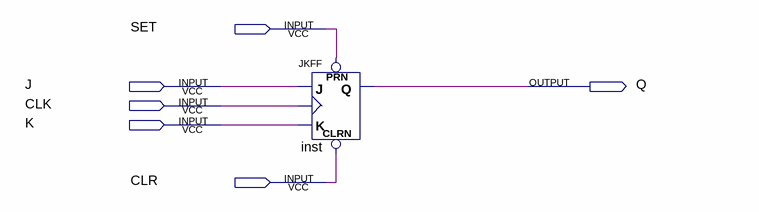
[diagram p0: schematic sheet]
// Quartus schematic ea01m02e02JK.bdf as structural Verilog: 1 symbols, 6 pins
module ea01m02e02JK (
  input  SET,
  input  J,
  input  CLK,
  input  K,
  input  CLR,
  output Q
);

  JKFF inst (.PRN(SET), .CLRN(CLR), .K(K), .J(J), .CLK(CLK), .Q(Q));
endmodule
